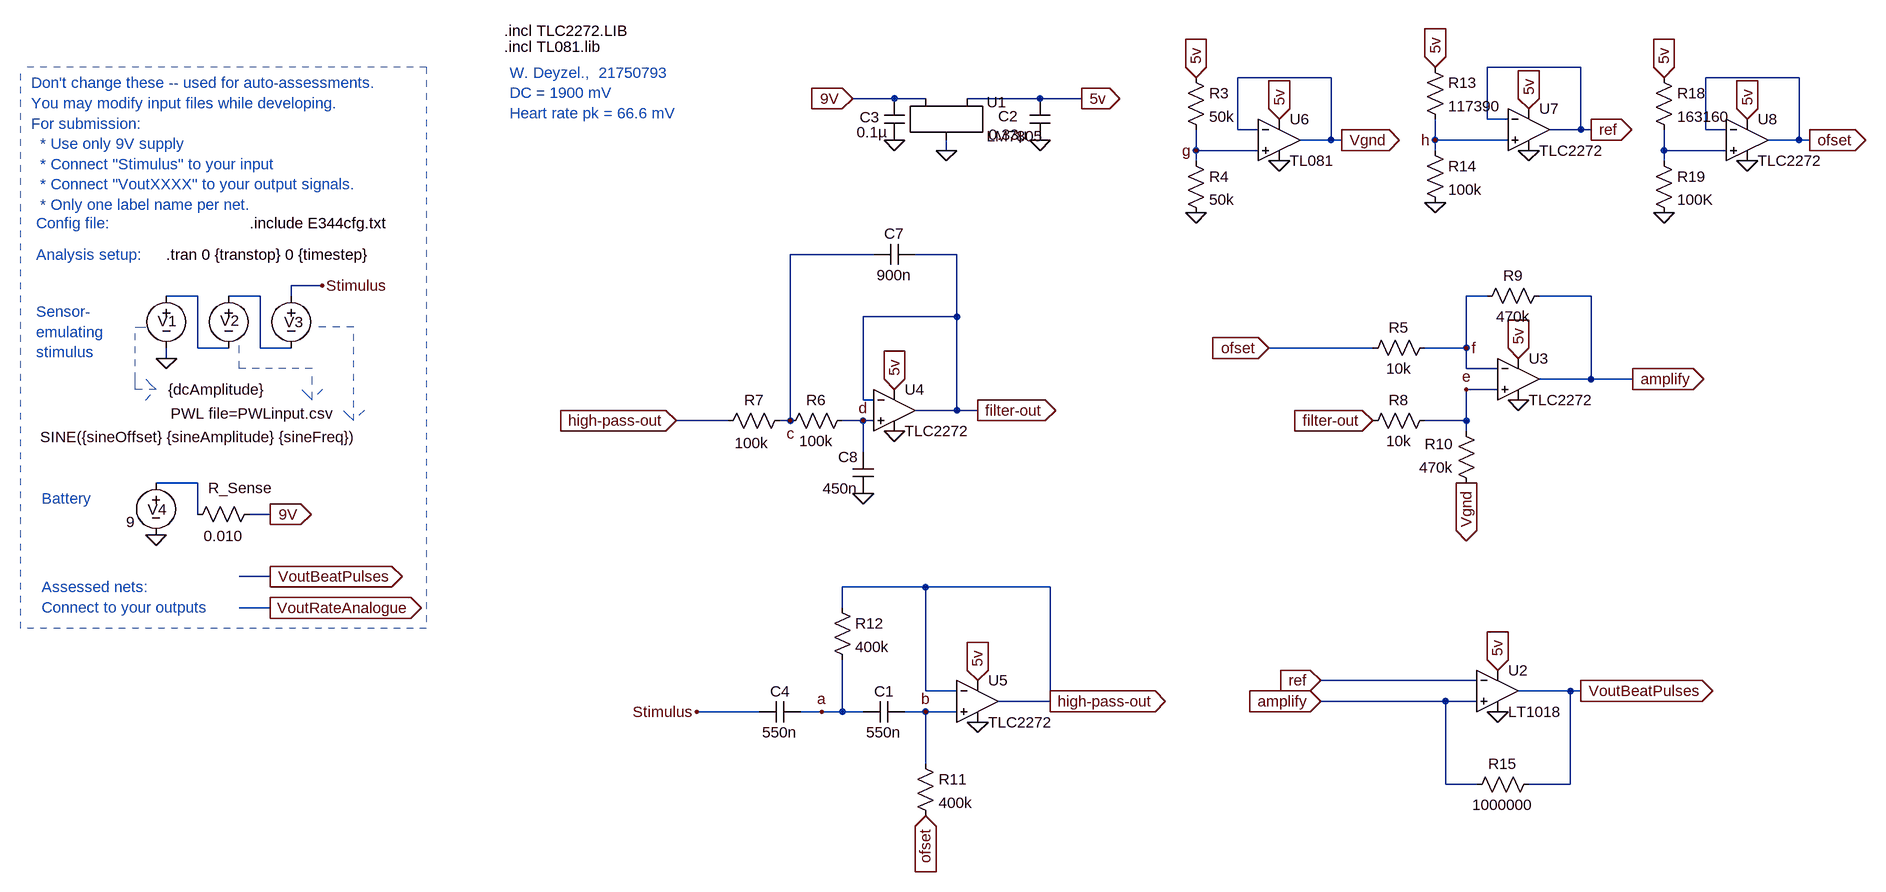
[diagram p0: schematic E344_Ass2_template.asc]
E344_Ass2_template.asc, the LTspice schematic file:
Version 4
SHEET 1 1872 680
WIRE 96 -1408 -48 -1408
WIRE -288 -1392 -432 -1392
WIRE 432 -1392 288 -1392
WIRE -960 -1360 -1024 -1360
WIRE -912 -1360 -960 -1360
WIRE -736 -1360 -848 -1360
WIRE -672 -1360 -736 -1360
WIRE -48 -1328 -48 -1408
WIRE -16 -1328 -48 -1328
WIRE -432 -1312 -432 -1392
WIRE -400 -1312 -432 -1312
WIRE 96 -1312 96 -1408
WIRE 96 -1312 48 -1312
WIRE 112 -1312 96 -1312
WIRE 288 -1312 288 -1392
WIRE 320 -1312 288 -1312
WIRE -288 -1296 -288 -1392
WIRE -288 -1296 -336 -1296
WIRE -272 -1296 -288 -1296
WIRE -128 -1296 -128 -1328
WIRE -16 -1296 -128 -1296
WIRE 432 -1296 432 -1392
WIRE 432 -1296 384 -1296
WIRE 448 -1296 432 -1296
WIRE -880 -1280 -880 -1296
WIRE -496 -1280 -496 -1312
WIRE -400 -1280 -496 -1280
WIRE -128 -1280 -128 -1296
WIRE 224 -1280 224 -1312
WIRE 320 -1280 224 -1280
WIRE -496 -1264 -496 -1280
WIRE 224 -1264 224 -1280
WIRE -992 -1120 -1120 -1120
WIRE -864 -1120 -928 -1120
WIRE -1840 -1072 -1888 -1072
WIRE -2032 -1056 -2080 -1056
WIRE -1936 -1056 -1984 -1056
WIRE -1888 -1056 -1888 -1072
WIRE -48 -1056 -80 -1056
WIRE 112 -1056 32 -1056
WIRE -864 -1024 -864 -1120
WIRE -864 -1024 -1008 -1024
WIRE -2032 -976 -2032 -1056
WIRE -1984 -976 -2032 -976
WIRE -1936 -976 -1936 -1056
WIRE -1888 -976 -1936 -976
WIRE -224 -976 -384 -976
WIRE -80 -976 -80 -1056
WIRE -80 -976 -144 -976
WIRE -2080 -960 -2080 -976
WIRE -80 -944 -80 -976
WIRE -32 -944 -80 -944
WIRE 112 -928 112 -1056
WIRE 112 -928 32 -928
WIRE 176 -928 112 -928
WIRE -32 -912 -80 -912
WIRE -1008 -896 -1008 -1024
WIRE -992 -896 -1008 -896
WIRE -864 -880 -864 -1024
WIRE -864 -880 -928 -880
WIRE -832 -880 -864 -880
WIRE -1216 -864 -1296 -864
WIRE -1120 -864 -1120 -1120
WIRE -1120 -864 -1136 -864
WIRE -1008 -864 -1040 -864
WIRE -992 -864 -1008 -864
WIRE -80 -864 -80 -912
WIRE -80 -864 -144 -864
WIRE -80 -848 -80 -864
WIRE -1008 -816 -1008 -864
WIRE -2032 -768 -2096 -768
WIRE -2032 -720 -2032 -768
WIRE -1920 -720 -1952 -720
WIRE -1920 -624 -1968 -624
WIRE -912 -608 -1040 -608
WIRE -720 -608 -912 -608
WIRE -1920 -576 -1968 -576
WIRE -1040 -576 -1040 -608
WIRE -64 -464 -304 -464
WIRE -912 -448 -912 -608
WIRE -864 -448 -912 -448
WIRE 80 -448 0 -448
WIRE 96 -448 80 -448
WIRE -720 -432 -720 -608
WIRE -720 -432 -800 -432
WIRE -112 -432 -304 -432
WIRE -64 -432 -112 -432
WIRE -1168 -416 -1264 -416
WIRE -1072 -416 -1104 -416
WIRE -1040 -416 -1040 -496
WIRE -1040 -416 -1072 -416
WIRE -1008 -416 -1040 -416
WIRE -912 -416 -944 -416
WIRE -864 -416 -912 -416
WIRE -912 -336 -912 -416
WIRE -112 -304 -112 -432
WIRE -64 -304 -112 -304
WIRE 80 -304 80 -448
WIRE 80 -304 16 -304
FLAG -2080 -960 0
FLAG -1840 -1072 Stimulus
FLAG -1920 -720 9V
IOPIN -1920 -720 Out
FLAG -2096 -688 0
FLAG -1920 -624 VoutBeatPulses
IOPIN -1920 -624 Out
FLAG -1264 -416 Stimulus
FLAG -1920 -576 VoutRateAnalogue
IOPIN -1920 -576 Out
FLAG 96 -448 VoutBeatPulses
IOPIN 96 -448 Out
FLAG -880 -1280 0
FLAG -1024 -1360 9V
IOPIN -1024 -1360 In
FLAG -960 -1296 0
FLAG -736 -1296 0
FLAG -672 -1360 5v
IOPIN -672 -1360 Out
FLAG -960 -848 0
FLAG -960 -912 5v
IOPIN -960 -912 In
FLAG -1008 -752 0
FLAG -496 -1392 5v
IOPIN -496 -1392 In
FLAG -496 -1184 0
FLAG -272 -1296 Vgnd
IOPIN -272 -1296 Out
FLAG -224 -864 filter-out
IOPIN -224 -864 In
FLAG 0 -896 0
FLAG 0 -960 5v
IOPIN 0 -960 In
FLAG -80 -768 Vgnd
IOPIN -80 -768 Out
FLAG -832 -880 filter-out
IOPIN -832 -880 Out
FLAG -832 -464 5v
IOPIN -832 -464 In
FLAG -832 -400 0
FLAG -720 -432 high-pass-out
IOPIN -720 -432 Out
FLAG -1296 -864 high-pass-out
IOPIN -1296 -864 In
FLAG -912 -256 ofset
IOPIN -912 -256 In
FLAG -384 -976 ofset
IOPIN -384 -976 In
FLAG -32 -416 0
FLAG -32 -480 5v
IOPIN -32 -480 In
FLAG 176 -928 amplify
IOPIN 176 -928 Out
FLAG -304 -432 amplify
IOPIN -304 -432 In
FLAG -304 -464 ref
IOPIN -304 -464 In
FLAG -368 -1264 0
FLAG -368 -1328 5v
IOPIN -368 -1328 In
FLAG -128 -1408 5v
IOPIN -128 -1408 In
FLAG -128 -1200 0
FLAG 112 -1312 ref
IOPIN 112 -1312 Out
FLAG 16 -1280 0
FLAG 16 -1344 5v
IOPIN 16 -1344 In
FLAG -1072 -416 a
FLAG -912 -416 b
FLAG -1120 -864 c
FLAG -1008 -864 d
FLAG -80 -912 e
FLAG -80 -976 f
FLAG -496 -1280 g
FLAG -128 -1296 h
FLAG 224 -1392 5v
IOPIN 224 -1392 In
FLAG 224 -1184 0
FLAG 448 -1296 ofset
IOPIN 448 -1296 Out
FLAG 352 -1264 0
FLAG 352 -1328 5v
IOPIN 352 -1328 In
SYMBOL voltage -1984 -1072 R0
WINDOW 123 0 0 Left 0
WINDOW 39 0 0 Left 0
WINDOW 3 -89 197 Left 2
WINDOW 0 -13 54 Left 2
SYMATTR Value PWL file=PWLinput.csv
SYMATTR InstName V2
SYMBOL voltage -1888 -1072 R0
WINDOW 123 24 44 Left 2
WINDOW 39 0 0 Left 0
WINDOW 3 -386 233 Left 2
WINDOW 0 -11 56 Left 2
SYMATTR Value SINE({sineOffset} {sineAmplitude} {sineFreq})
SYMATTR InstName V3
SYMBOL voltage -2080 -1072 R0
WINDOW 123 0 0 Left 0
WINDOW 39 0 0 Left 0
WINDOW 3 3 160 Left 2
WINDOW 0 -13 55 Left 2
SYMATTR Value {dcAmplitude}
SYMATTR InstName V1
SYMBOL voltage -2096 -784 R0
WINDOW 123 24 44 Left 2
WINDOW 39 0 0 Left 0
WINDOW 3 -46 76 Left 2
WINDOW 0 -13 57 Left 2
SYMATTR Value 9
SYMATTR InstName V4
SYMBOL res -1936 -736 R90
WINDOW 0 -9 30 VBottom 2
WINDOW 3 34 56 VTop 2
SYMATTR InstName R_Sense
SYMATTR Value 0.010
SYMBOL LM7805 -880 -1344 R0
SYMATTR InstName U1
SYMBOL cap -752 -1360 R0
WINDOW 3 -63 56 Left 2
WINDOW 0 -48 27 Left 2
SYMATTR Value 0.33µ
SYMATTR InstName C2
SYMBOL cap -976 -1360 R0
WINDOW 0 -37 29 Left 2
WINDOW 3 -42 52 Left 2
SYMATTR InstName C3
SYMATTR Value 0.1µ
SYMBOL res -1024 -880 R90
WINDOW 0 0 56 VBottom 2
WINDOW 3 32 56 VTop 2
SYMATTR InstName R6
SYMATTR Value 100k
SYMBOL res -1120 -880 R90
WINDOW 0 0 56 VBottom 2
WINDOW 3 35 59 VTop 2
SYMATTR InstName R7
SYMATTR Value 100k
SYMBOL cap -928 -1136 R90
WINDOW 0 0 32 VBottom 2
WINDOW 3 32 32 VTop 2
SYMATTR InstName C7
SYMATTR Value 900n
SYMBOL cap -992 -752 R180
WINDOW 0 24 56 Left 2
WINDOW 3 24 8 Left 2
SYMATTR InstName C8
SYMATTR Value 450n
SYMBOL Opamps\\opamp2 -960 -944 R0
SYMATTR InstName U4
SYMATTR Value TLC2272
SYMBOL res -512 -1408 R0
SYMATTR InstName R3
SYMATTR Value 50k
SYMBOL res -512 -1280 R0
SYMATTR InstName R4
SYMATTR Value 50k
SYMBOL res -128 -992 R90
WINDOW 0 0 56 VBottom 2
WINDOW 3 32 56 VTop 2
SYMATTR InstName R5
SYMATTR Value 10k
SYMBOL res -128 -880 R90
WINDOW 0 0 56 VBottom 2
WINDOW 3 32 56 VTop 2
SYMATTR InstName R8
SYMATTR Value 10k
SYMBOL res 48 -1072 R90
WINDOW 0 0 56 VBottom 2
WINDOW 3 32 56 VTop 2
SYMATTR InstName R9
SYMATTR Value 470k
SYMBOL res -64 -752 R180
WINDOW 0 36 76 Left 2
WINDOW 3 36 40 Left 2
SYMATTR InstName R10
SYMATTR Value 470k
SYMBOL Opamps\\opamp2 0 -992 R0
SYMATTR InstName U3
SYMATTR Value TLC2272
SYMBOL Opamps\\opamp2 -832 -496 R0
SYMATTR InstName U5
SYMATTR Value TLC2272
SYMBOL res -928 -352 R0
SYMATTR InstName R11
SYMATTR Value 400k
SYMBOL res -1056 -592 R0
SYMATTR InstName R12
SYMATTR Value 400k
SYMBOL cap -944 -432 R90
WINDOW 0 0 32 VBottom 2
WINDOW 3 32 32 VTop 2
SYMATTR InstName C1
SYMATTR Value 550n
SYMBOL cap -1104 -432 R90
WINDOW 0 0 32 VBottom 2
WINDOW 3 32 32 VTop 2
SYMATTR InstName C4
SYMATTR Value 550n
SYMBOL res -144 -1424 R0
SYMATTR InstName R13
SYMATTR Value 117390
SYMBOL res -144 -1296 R0
SYMATTR InstName R14
SYMATTR Value 100k
SYMBOL res 32 -320 R90
WINDOW 0 0 56 VBottom 2
WINDOW 3 32 56 VTop 2
SYMATTR InstName R15
SYMATTR Value 1000000
SYMBOL Opamps\\opamp2 -368 -1360 R0
SYMATTR InstName U6
SYMATTR Value TL081
SYMBOL Opamps\\opamp2 16 -1376 R0
SYMATTR InstName U7
SYMATTR Value TLC2272
SYMBOL res 208 -1408 R0
SYMATTR InstName R18
SYMATTR Value 163160
SYMBOL res 208 -1280 R0
SYMATTR InstName R19
SYMATTR Value 100K
SYMBOL Opamps\\opamp2 352 -1360 R0
SYMATTR InstName U8
SYMATTR Value TLC2272
SYMBOL Comparators\\LT1018 -32 -448 R0
SYMATTR InstName U2
TEXT -2080 -1120 Left 2 !.tran 0 {transtop} 0 {timestep}
TEXT -1952 -1168 Left 2 !.include E344cfg.txt
TEXT -2288 -1384 Left 2 ;Don't change these -- used for auto-assessments.\nYou may modify input files while developing.\nFor submission: \n  * Use only 9V supply \n  * Connect "Stimulus" to your input\n  * Connect "VoutXXXX" to your output signals.\n  * Only one label name per net.
TEXT -2280 -1168 Left 2 ;Config file:
TEXT -2280 -1120 Left 2 ;Analysis setup:
TEXT -2272 -744 Left 2 ;Battery
TEXT -2280 -1032 Left 2 ;Sensor-\nemulating \nstimulus
TEXT -2272 -608 Left 2 ;Assessed nets:\nConnect to your outputs
TEXT -1552 -1400 Left 2 ;W. Deyzel.,  21750793\nDC = 1900 mV\nHeart rate pk = 66.6 mV
TEXT -1560 -1464 Left 2 !.incl TLC2272.LIB
TEXT -1560 -1440 Left 2 !.incl TL081.lib
LINE Normal -1792 -1008 -1856 -1008 2
LINE Normal -1792 -864 -1792 -1008 2
LINE Normal -1808 -880 -1792 -864 2
LINE Normal -1792 -864 -1808 -880 2
LINE Normal -1776 -880 -1792 -864 2
LINE Normal -2128 -1008 -2112 -1008 2
LINE Normal -2128 -928 -2128 -1008 2
LINE Normal -2128 -912 -2128 -928 2
LINE Normal -2096 -912 -2128 -912 2
LINE Normal -2112 -928 -2096 -912 2
LINE Normal -2096 -912 -2112 -928 2
LINE Normal -2112 -896 -2096 -912 2
LINE Normal -1968 -944 -1968 -992 2
LINE Normal -1856 -944 -1968 -944 2
LINE Normal -1856 -896 -1856 -944 2
LINE Normal -1872 -912 -1856 -896 2
LINE Normal -1856 -896 -1872 -912 2
LINE Normal -1840 -912 -1856 -896 2
LINE Normal -2304 -544 -2304 -1408 1
LINE Normal -1680 -1408 -1680 -544 1
LINE Normal -1680 -544 -2304 -544 1
LINE Normal -1680 -1408 -2304 -1408 1

The netlist it stands for:
* E344_Ass2_template.asc
V2 N003 N002 PWL file=PWLinput.csv
V3 Stimulus N003 SINE({sineOffset} {sineAmplitude} {sineFreq})
V1 N002 0 {dcAmplitude}
V4 N004 0 9
R_Sense 9V N004 0.010
XU1 9V 0 5v LM7805
C2 5v 0 0.33µ
C3 9V 0 0.1µ
R6 d c 100k
R7 c high-pass-out 100k
C7 filter-out c 900n
C8 0 d 450n
XU4 d filter-out 5v 0 filter-out TLC2272  ; pins In+ In- V+ V- OUT
R3 5v g 50k
R4 g 0 50k
R5 f ofset 10k
R8 e filter-out 10k
R9 amplify f 470k
R10 Vgnd e 470k
XU3 e f 5v 0 amplify TLC2272  ; pins In+ In- V+ V- OUT
XU5 b high-pass-out 5v 0 high-pass-out TLC2272  ; pins In+ In- V+ V- OUT
R11 b ofset 400k
R12 high-pass-out a 400k
C1 b a 550n
C4 a Stimulus 550n
R13 5v h 117390
R14 h 0 100k
R15 VoutBeatPulses amplify 1000000
XU6 g Vgnd 5v 0 Vgnd TL081  ; pins In+ In- V+ V- OUT
XU7 h ref 5v 0 ref TLC2272  ; pins In+ In- V+ V- OUT
R18 5v N001 163160
R19 N001 0 100K
XU8 N001 ofset 5v 0 ofset TLC2272  ; pins In+ In- V+ V- OUT
XU2 amplify ref 5v 0 VoutBeatPulses LT1018  ; pins In+ In- V+ V- OUT
.tran 0 {transtop} 0 {timestep}
.include E344cfg.txt
* Don't change these -- used for auto-assessments.
* You may modify input files while developing.
* For submission:
*   * Use only 9V supply
*   * Connect "Stimulus" to your input
*   * Connect "VoutXXXX" to your output signals.
*   * Only one label name per net.
* Config file:
* Analysis setup:
* Battery
* Sensor-
* emulating
* stimulus
* Assessed nets:
* Connect to your outputs
* W. Deyzel.,  21750793
* DC = 1900 mV
* Heart rate pk = 66.6 mV
.incl TLC2272.LIB
.incl TL081.lib
.lib LTC1.lib
.backanno
.end